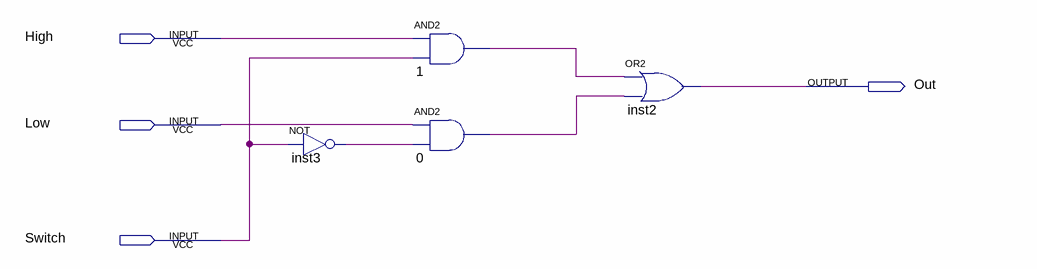
[diagram p0: schematic sheet]
// Quartus schematic Lab05.bdf as structural Verilog: 4 symbols, 4 pins
module Lab05 (
  input  High,
  input  Low,
  input  Switch,
  output Out
);

  wire inst3_out, n0_out, n1_out;

  not inst3 (inst3_out, Switch);
  and u_1 (n1_out, High, Switch);
  and u_0 (n0_out, Low, inst3_out);
  or inst2 (Out, n1_out, n0_out);
endmodule
